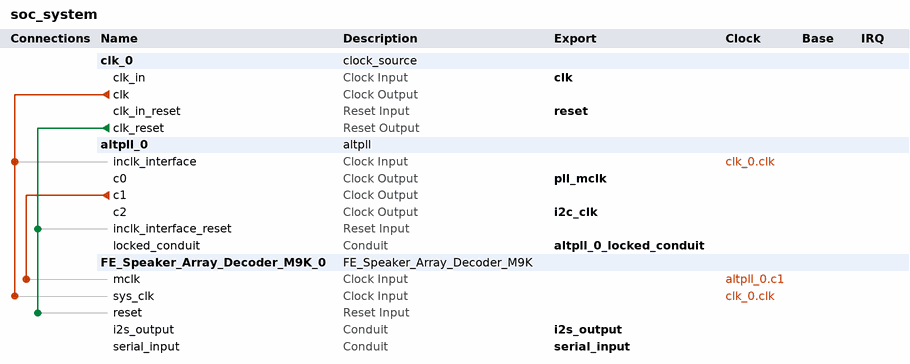
[diagram p0: system contents]
# Platform Designer (Qsys) system soc_system, MAX 10 10M08SAE144C8GES
# Parameters at their usual value, and those the tool derives, are not listed.
package require -exact qsys 18.0
create_system soc_system
set_project_property DEVICE_FAMILY {MAX 10}
set_project_property DEVICE 10M08SAE144C8GES

add_instance clk_0 clock_source 18.0
set_instance_parameter_value clk_0 clockFrequency 50000000

add_instance altpll_0 altpll 18.0
set_instance_parameter_value altpll_0 CLK0_DIVIDE_BY 3125
set_instance_parameter_value altpll_0 CLK0_MULTIPLY_BY 768
set_instance_parameter_value altpll_0 CLK1_DIVIDE_BY 3125
set_instance_parameter_value altpll_0 CLK1_DUTY_CYCLE 50
set_instance_parameter_value altpll_0 CLK1_MULTIPLY_BY 768
set_instance_parameter_value altpll_0 CLK1_PHASE_SHIFT 0
set_instance_parameter_value altpll_0 CLK2_DIVIDE_BY 500
set_instance_parameter_value altpll_0 CLK2_DUTY_CYCLE 50
set_instance_parameter_value altpll_0 CLK2_MULTIPLY_BY 1
set_instance_parameter_value altpll_0 CLK2_PHASE_SHIFT 0
set_instance_parameter_value altpll_0 INCLK0_INPUT_FREQUENCY 20000
set_instance_parameter_value altpll_0 PORT_ARESET PORT_UNUSED
set_instance_parameter_value altpll_0 PORT_LOCKED PORT_USED
set_instance_parameter_value altpll_0 PORT_clk1 PORT_USED
set_instance_parameter_value altpll_0 PORT_clk2 PORT_USED
set_instance_parameter_value altpll_0 PORT_clk3 PORT_UNUSED

add_instance FE_Speaker_Array_Decoder_M9K_0 FE_Speaker_Array_Decoder_M9K 1.0
set_instance_parameter_value FE_Speaker_Array_Decoder_M9K_0 max_drivers 32

# connections
add_connection altpll_0.c1 FE_Speaker_Array_Decoder_M9K_0.mclk clock
add_connection clk_0.clk altpll_0.inclk_interface clock
add_connection clk_0.clk FE_Speaker_Array_Decoder_M9K_0.sys_clk clock
add_connection clk_0.clk_reset altpll_0.inclk_interface_reset reset
add_connection clk_0.clk_reset FE_Speaker_Array_Decoder_M9K_0.reset reset

# exported interfaces
add_interface altpll_0_locked_conduit conduit end
set_interface_property altpll_0_locked_conduit EXPORT_OF altpll_0.locked_conduit
add_interface clk clock sink
set_interface_property clk EXPORT_OF clk_0.clk_in
add_interface i2c_clk clock source
set_interface_property i2c_clk EXPORT_OF altpll_0.c2
add_interface i2s_output conduit end
set_interface_property i2s_output EXPORT_OF FE_Speaker_Array_Decoder_M9K_0.i2s_output
add_interface pll_mclk clock source
set_interface_property pll_mclk EXPORT_OF altpll_0.c0
add_interface reset reset sink
set_interface_property reset EXPORT_OF clk_0.clk_in_reset
add_interface serial_input conduit end
set_interface_property serial_input EXPORT_OF FE_Speaker_Array_Decoder_M9K_0.serial_input

set_interconnect_requirement {$system} qsys_mm.clockCrossingAdapter HANDSHAKE
set_interconnect_requirement {$system} qsys_mm.enableEccProtection FALSE
set_interconnect_requirement {$system} qsys_mm.insertDefaultSlave FALSE
set_interconnect_requirement {$system} qsys_mm.maxAdditionalLatency 1

save_system soc_system.qsys
